# EAGLE design PulseChord (EAGLE 9.6.2)
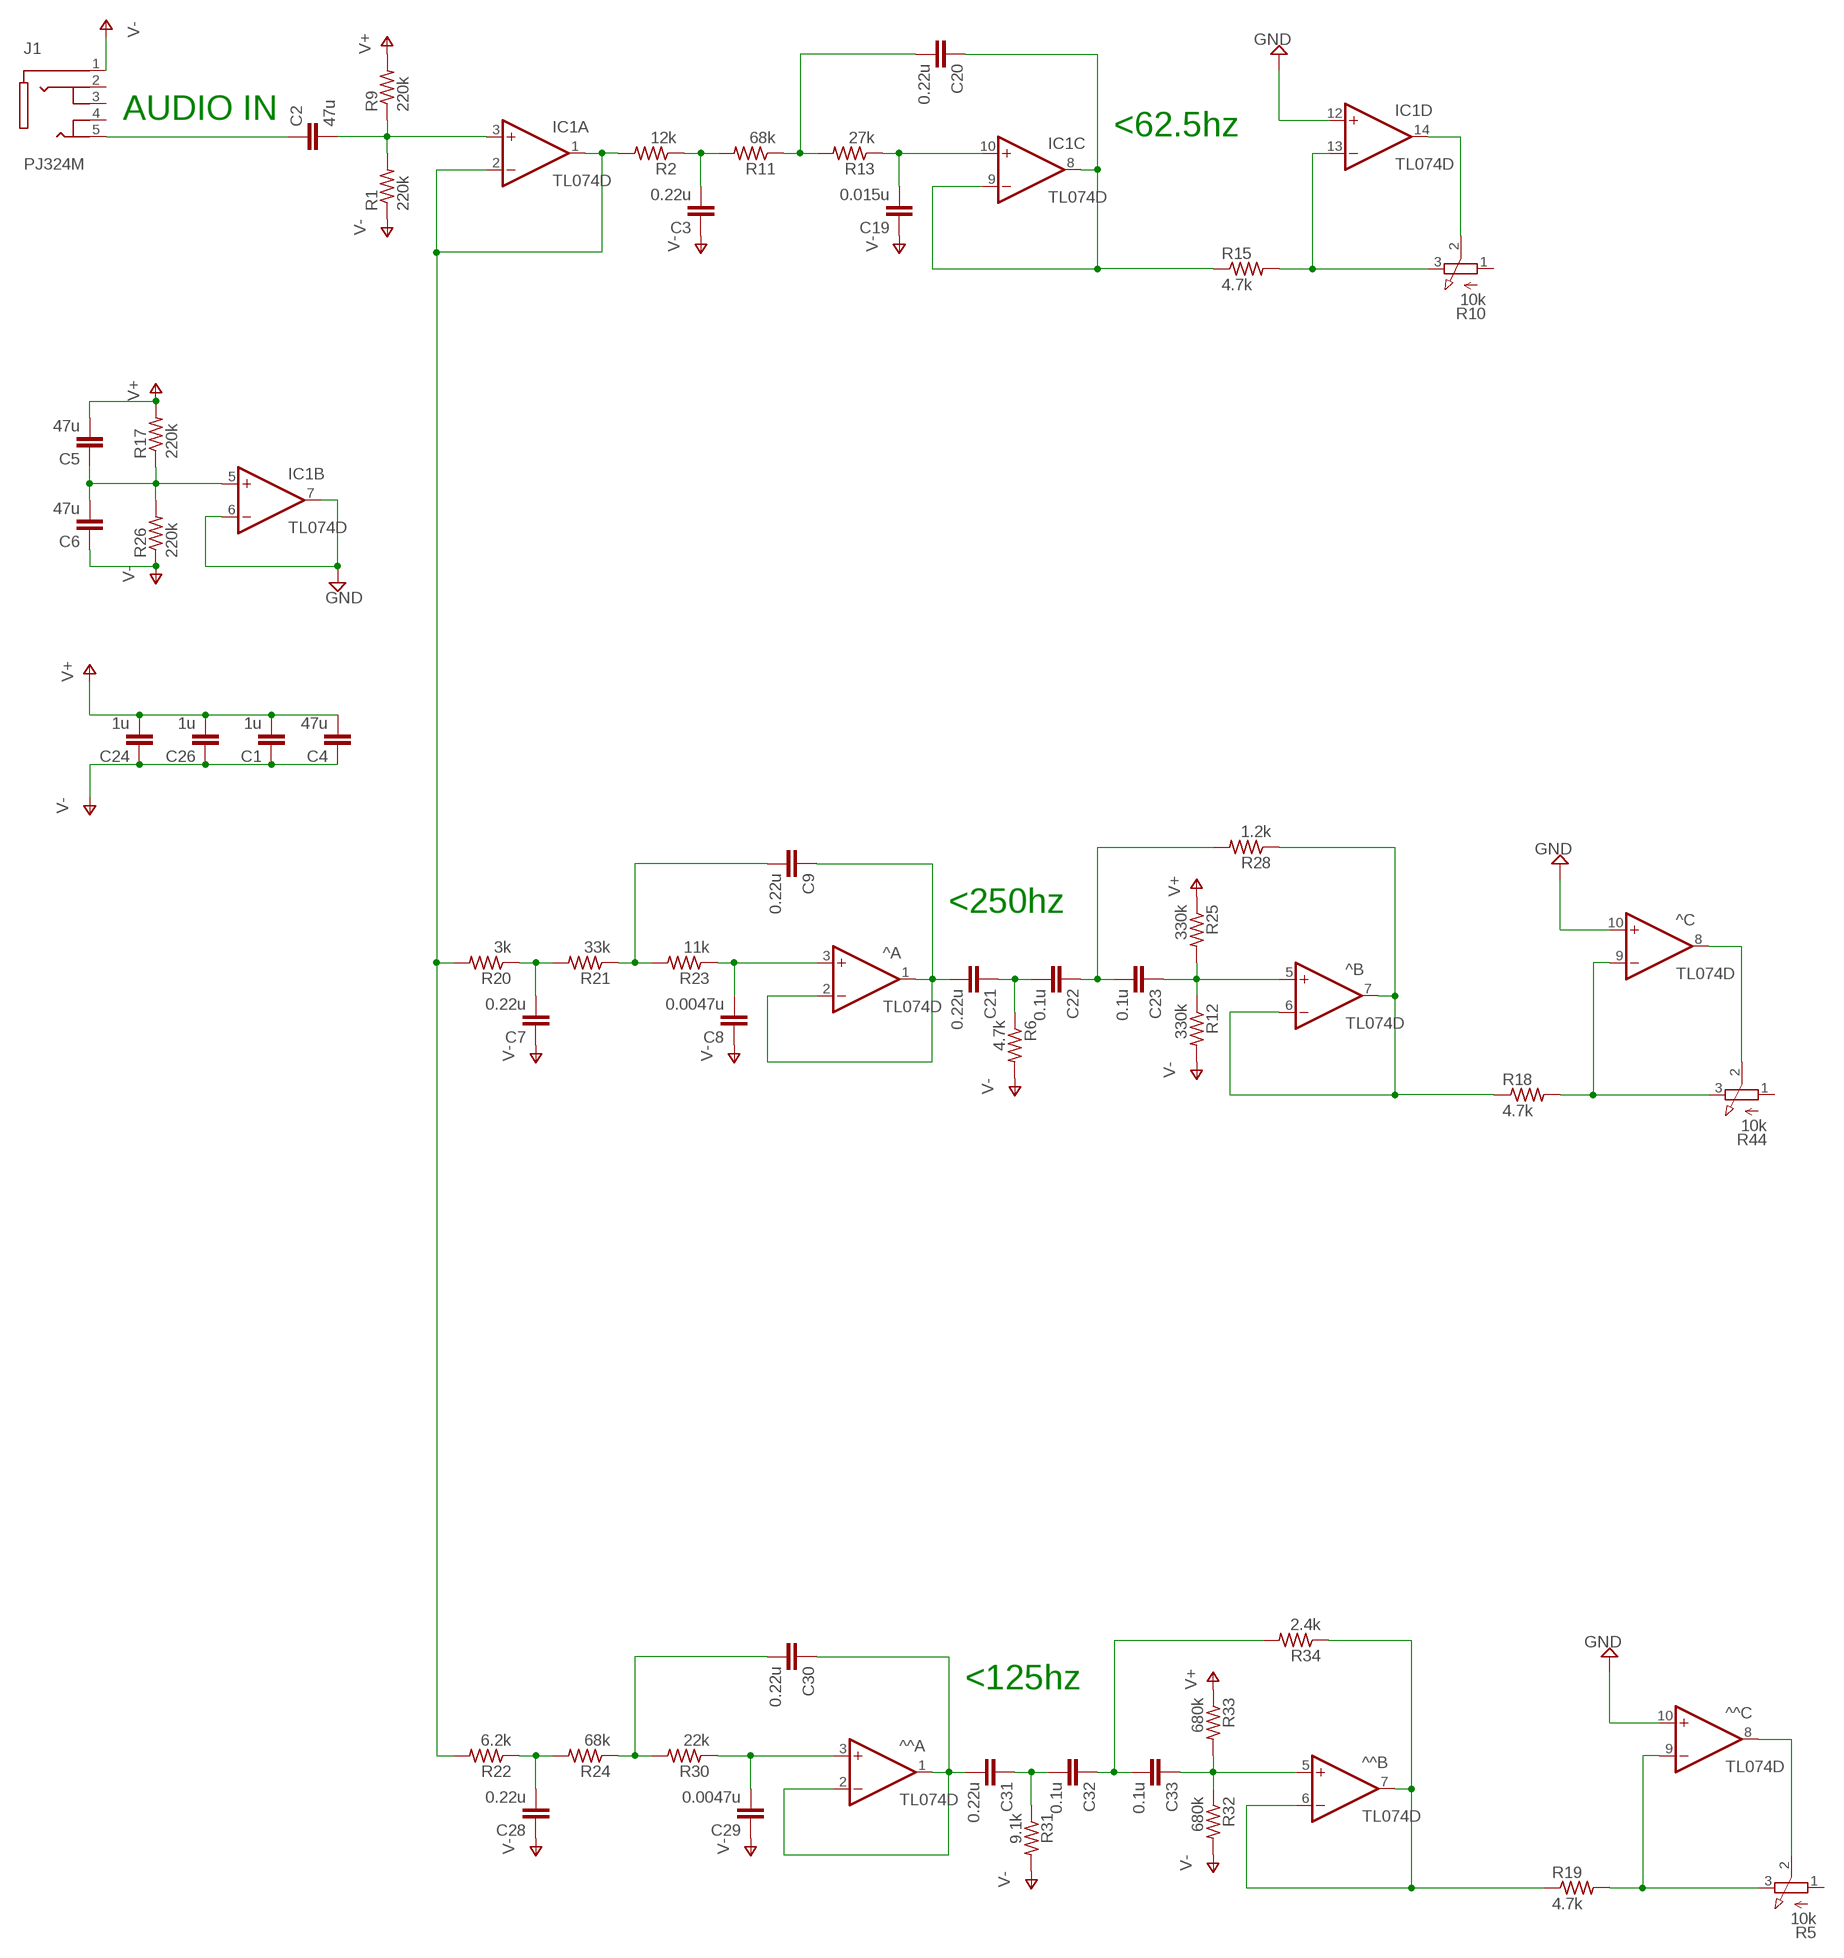
[diagram p0: schematic, sheet 1]

## Parts
^  TL074D  [SO14]
^^  TL074D  [SO14]
C1  1u  C-EUC0603  [C0603]
C2  47u  C-EUC0603  [C0603]
C3  0.22u  C-EUC0603  [C0603]
C4  47u  C-EUC0603  [C0603]
C5  47u  C-EUC0603  [C0603]
C6  47u  C-EUC0603  [C0603]
C7  0.22u  C-EUC0603  [C0603]
C8  0.0047u  C-EUC0603  [C0603]
C9  0.22u  C-EUC0603  [C0603]
C19  0.015u  C-EUC0603  [C0603]
C20  0.22u  C-EUC0603  [C0603]
C21  0.22u  C-EUC0603  [C0603]
C22  0.1u  C-EUC0603  [C0603]
C23  0.1u  C-EUC0603  [C0603]
C24  1u  C-EUC0603  [C0603]
C26  1u  C-EUC0603  [C0603]
C28  0.22u  C-EUC0603  [C0603]
C29  0.0047u  C-EUC0603  [C0603]
C30  0.22u  C-EUC0603  [C0603]
C31  0.22u  C-EUC0603  [C0603]
C32  0.1u  C-EUC0603  [C0603]
C33  0.1u  C-EUC0603  [C0603]
IC1  TL074D  [SO14]
J1  PJ324M  [WENZHOU_PJ324M]
R1  220k  R-US_R0603  [R0603]
R2  12k  R-US_R0603  [R0603]
R5  10k  3RP/1610N  [3RP/1610N]
R6  4.7k  R-US_R0603  [R0603]
R9  220k  R-US_R0603  [R0603]
R10  10k  3RP/1610N  [3RP/1610N]
R11  68k  R-US_R0603  [R0603]
R12  330k  R-US_R0603  [R0603]
R13  27k  R-US_R0603  [R0603]
R15  4.7k  R-US_R0603  [R0603]
R17  220k  R-US_R0603  [R0603]
R18  4.7k  R-US_R0603  [R0603]
R19  4.7k  R-US_R0603  [R0603]
R20  3k  R-US_R0603  [R0603]
R21  33k  R-US_R0603  [R0603]
R22  6.2k  R-US_R0603  [R0603]
R23  11k  R-US_R0603  [R0603]
R24  68k  R-US_R0603  [R0603]
R25  330k  R-US_R0603  [R0603]
R26  220k  R-US_R0603  [R0603]
R28  1.2k  R-US_R0603  [R0603]
R30  22k  R-US_R0603  [R0603]
R31  9.1k  R-US_R0603  [R0603]
R32  680k  R-US_R0603  [R0603]
R33  680k  R-US_R0603  [R0603]
R34  2.4k  R-US_R0603  [R0603]
R44  10k  3RP/1610N  [3RP/1610N]

## Nets
GND: ^.10(C:+IN) ^^.10(C:+IN) IC1.6(B:-IN) IC1.7(B:OUT) IC1.12(D:+IN)
N$1: IC1.1(A:OUT) IC1.2(A:-IN) R2.2 R20.2 R22.2
N$2: C2.2 IC1.3(A:+IN) R1.2 R9.1
N$3: ^^.9(C:-IN) R5.3(E) R19.2
N$6: ^^.8(C:OUT) R5.2(S)
N$7: C5.1 C6.2 IC1.5(B:+IN) R17.1 R26.2
N$9: ^.3(A:+IN) C8.2 R23.1
N$11: IC1.13(D:-IN) R10.3(E) R15.2
N$12: C9.2 R21.1 R23.2
N$13: C3.2 R2.1 R11.2
N$14: C2.1 J1.5(TIP_2)
N$16: C21.1 C22.2 R6.1
N$17: ^.1(A:OUT) ^.2(A:-IN) C9.1 C21.2
N$19: C31.1 C32.2 R31.1
N$20: C19.2 IC1.10(C:+IN) R13.1
N$23: ^^.1(A:OUT) ^^.2(A:-IN) C30.1 C31.2
N$25: C32.1 C33.2 R34.2
N$27: C22.1 C23.2 R28.2
N$29: ^^.5(B:+IN) C33.1 R32.1 R33.2
N$30: C7.2 R20.1 R21.2
N$32: ^^.6(B:-IN) ^^.7(B:OUT) R19.1 R34.1
N$33: C28.2 R22.1 R24.2
N$34: IC1.14(D:OUT) R10.2(S)
N$35: C20.2 R11.1 R13.2
N$36: ^.9(C:-IN) R18.2 R44.3(E)
N$37: ^.5(B:+IN) C23.1 R12.1 R25.2
N$38: ^.8(C:OUT) R44.2(S)
N$41: C30.2 R24.1 R30.2
N$43: ^.6(B:-IN) ^.7(B:OUT) R18.1 R28.1
N$46: C20.1 IC1.8(C:OUT) IC1.9(C:-IN) R15.1
N$47: ^^.3(A:+IN) C29.2 R30.1
V+: C1.2 C4.2 C5.2 C24.2 C26.2 R9.2 R17.2 R25.1 R33.1
V-: C1.1 C3.1 C4.1 C6.1 C7.1 C8.1 C19.1 C24.1 C26.1 C28.1 C29.1 J1.1(SLEEVE) R1.1 R6.2 R12.2 R26.1 R31.2 R32.2
Unconnected: ^.12(D:+IN) ^.13(D:-IN) ^.14(D:OUT) ^^.12(D:+IN) ^^.13(D:-IN) ^^.14(D:OUT) J1.2(RING_1) J1.3(RING_2) J1.4(TIP_1) R5.1(A) R10.1(A) R44.1(A)

## Notes on the sheet
- AUDIO IN
- <62.5hz
- <250hz
- <125hz

## Power pins joined to a net without a drawn wire
V+: ^.4(P:V+) ^^.4(P:V+) IC1.4(P:V+)
V-: ^.11(P:V-) ^^.11(P:V-) IC1.11(P:V-)

## Library data of the parts
^ ^^ IC1 = linear:TL074: OP AMP
C1-C9 C19-C24 C26 C28-C33 = rcl:C-EU: CAPACITOR, European symbol; SPICEPREFIX: C
J1 = PJ324M:PJ324M: Check availability <https://pricing.snapeda.com/parts/PJ324M/Wenzhou%20QingPu%20Electronics%20Co.Ltd/view-part?ref=eda>; AVAILABILITY: Not in stock; CHECK_PRICES: https://www.snapeda.com/parts/PJ324M/Wenzhou+QingPu+Electronics+Co.Ltd/view-part/?ref=eda; DESCRIPTION: Headphone Stereo jack/Audio connector; MF: Wenzhou QingPu Electronics Co.Ltd; MP: PJ324M; PACKAGE: Package; PRICE: None; SNAPEDA_LINK: https://www.snapeda.com/parts/PJ324M/Wenzhou+QingPu+Electronics+Co.Ltd/view-part/?ref=snap
R1 R2 R6 R9 R11-R13 R15 R17-R26 R28 R30-R34 = rcl:R-US_: RESISTOR, American symbol; SPICEPREFIX: R
R5 R10 R44 = pot:3RP/1610N: 16mm Potentiometer one level Source: http://www.alphapotentiometers.net/html/16mm_pot_2.html

## Board
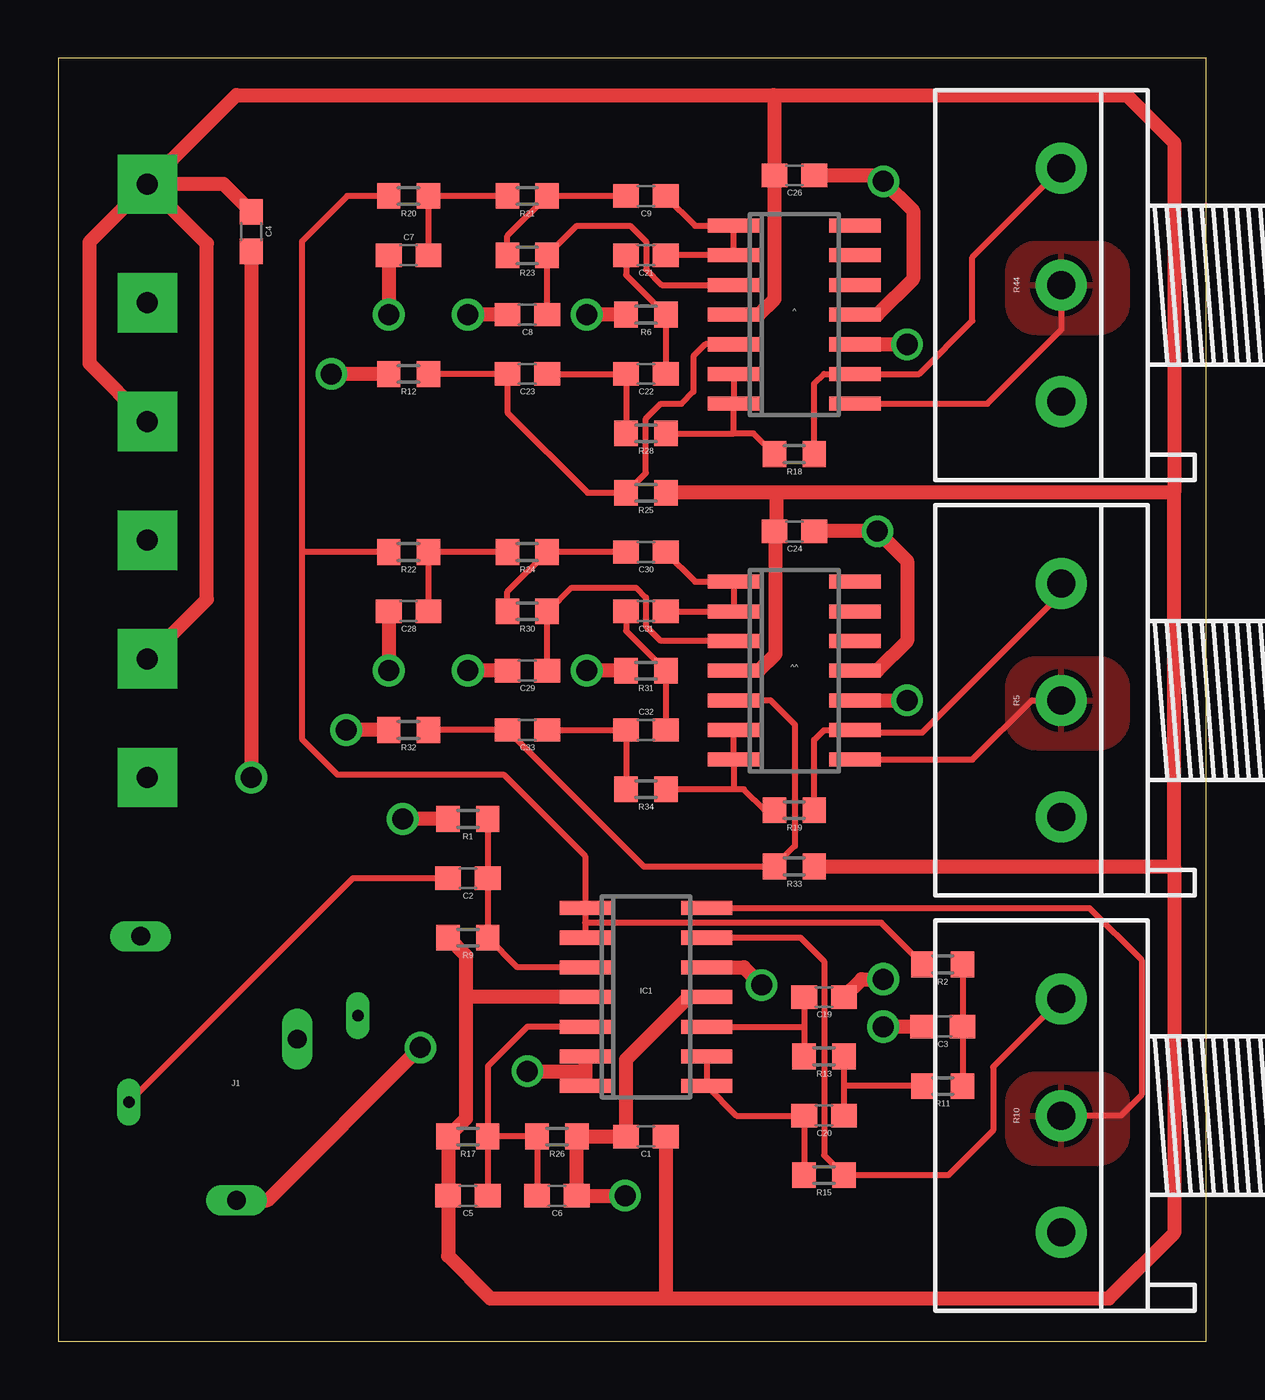
[diagram p1: board, top side]
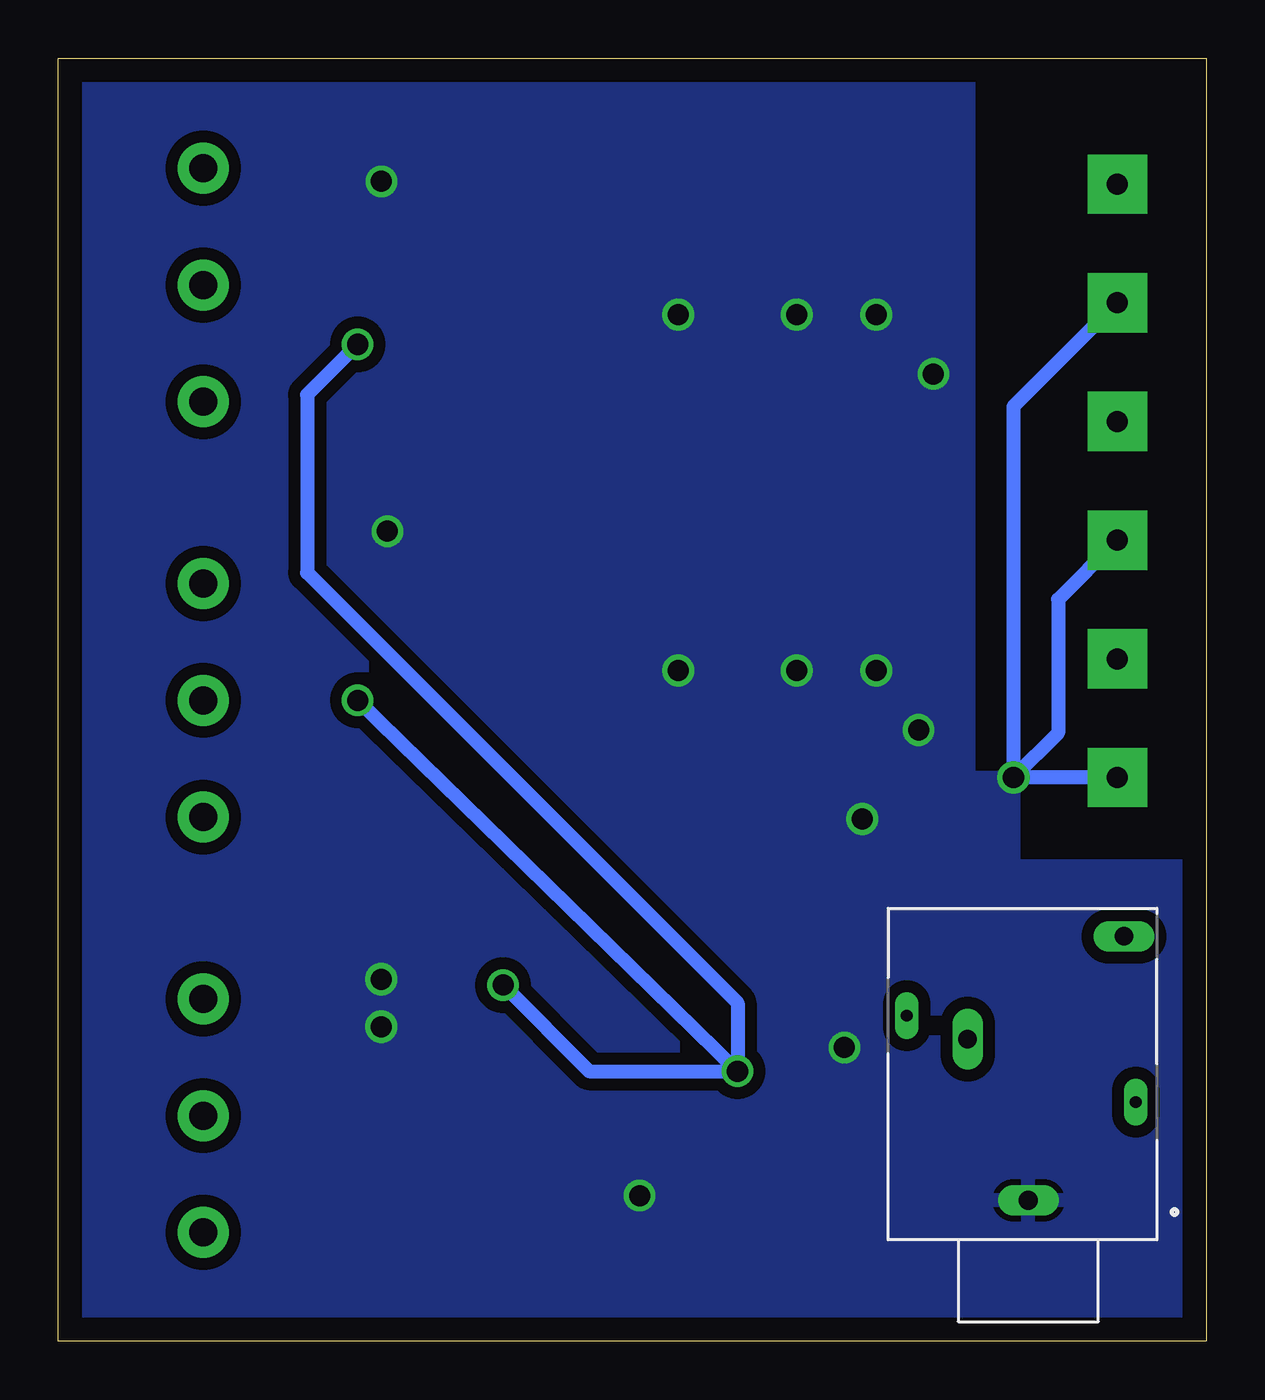
[diagram p2: board, bottom side, seen from below]

Size 49.13 x 54.91 mm. Coordinates in mm from the lower left corner, seen from the top.
Outline: 0,0 49.13,0 49.13,54.91 0,54.91 0,0
Copper layers (1*16): Top 0.035mm / dielectric 1.5mm / Bottom 0.035mm
Design rules "default": minimum track width 6mil, minimum drill 0.35mm, track to track 6mil, track to pad 6mil, pad to pad 6mil, via to via 6mil, smd to smd 6mil, copper to edge 40mil, drill to drill 6mil, minimum pad ring 10mil, minimum via ring 8mil, stop-mask expansion 4mil, vias tented up to drill 0mil, thermal gap 10mil

### Footprints (pad centres in the part's own frame; a part is rotated, then mirrored left to right if it is on the bottom)
SO14 = smd 0.6 x 2.2: 1 -3.81,-2.6; 2 -2.54,-2.6; 3 -1.27,-2.6; 4 0,-2.6; 5 1.27,-2.6; 6 2.54,-2.6; 7 3.81,-2.6; 8 3.81,2.6; 9 2.54,2.6; 10 1.27,2.6; 11 0,2.6; 12 -1.27,2.6; 13 -2.54,2.6; 14 -3.81,2.6
C0603 = smd 1.1 x 1: 1 -0.85,0; 2 0.85,0
WENZHOU_PJ324M = drill 0.8 long: 1 0,5.4; 3 2.6,-1.5; 4 -4.1,-5.9 | drill 0.5 long: 2 5.2,-2.5; 5 -4.6,1.2
R0603 = smd 1 x 1.1: 1 -0.85,0; 2 0.85,0
3RP/1610N = drill 1.2 pad 2.184: 1 -5,0; 2 0,0; 3 5,0

### Placement (x,y rotation side)
^  31.5,43.94 270 top
^^  31.5,28.7 270 top
C1  25.15,8.76 0 top
C2  17.53,19.81 0 top
C3  37.85,13.46 0 top
C4  8.26,47.5 90 top
C5  17.53,6.22 180 top
C6  21.34,6.22 180 top
C7  14.99,46.48 0 top
C8  20.07,43.94 0 top
C9  25.15,49.02 180 top
C19  32.77,14.73 180 top
C20  32.77,9.65 0 top
C21  25.15,46.48 0 top
C22  25.15,41.4 0 top
C23  20.07,41.4 0 top
C24  31.5,34.67 180 top
C26  31.5,49.91 180 top
C28  14.99,31.24 0 top
C29  20.07,28.7 0 top
C30  25.15,33.78 180 top
C31  25.15,31.24 0 top
C32  25.15,26.16 0 top
C33  20.07,26.16 0 top
IC1  25.15,14.73 270 top
J1  7.62,11.43 180 bottom
R1  17.53,22.35 0 top
R2  37.85,16.13 180 top
R5  42.93,27.43 90 top
R6  25.15,43.94 180 top
R9  17.53,17.27 180 top
R10  42.93,9.65 90 top
R11  37.85,10.92 0 top
R12  14.99,41.4 180 top
R13  32.77,12.19 0 top
R15  32.77,7.11 0 top
R17  17.53,8.76 180 top
R18  31.5,37.97 0 top
R19  31.5,22.73 0 top
R20  14.99,49.02 180 top
R21  20.07,49.02 180 top
R22  14.99,33.78 180 top
R23  20.07,46.48 180 top
R24  20.07,33.78 180 top
R25  25.15,36.32 180 top
R26  21.34,8.76 180 top
R28  25.15,38.86 180 top
R30  20.07,31.24 180 top
R31  25.15,28.7 180 top
R32  14.99,26.16 180 top
R33  31.5,20.32 180 top
R34  25.15,23.62 180 top
R44  42.93,45.21 90 top

### Tracks (layer width: path | path; a pad name or v marks a point on that pad's centre or on a via)
GND  (via drill 0.9 pad 0.25, 0.9 pad 1.35)
  Top 0.61: ^^.10 v36.32,27.43 | IC1.6 22.55,11.43 | 22.55,11.43 IC1.7 | v20.07,11.56 22.42,11.56 22.55,11.43 | IC1.12 29.34,16 v30.1,15.24 | ^.10 v36.32,42.67
  Bottom 0.61: v20.07,11.56 v36.32,27.43 | v36.32,42.67 38.48,40.51 38.48,32.89 20.07,14.48 v20.07,11.56 | v30.1,15.24 26.42,11.56 v20.07,11.56
N$1
  Top 0.254: 22.55,17.91 IC1.1 22.55,20.76 19.05,24.26 11.94,24.26 10.41,25.78 10.41,33.78 | 22.55,17.91 IC1.2 | R20.2 12.36,49.02 10.41,47.08 10.41,33.78 | R22.2 10.41,33.78 | R2.2 35.22,17.91 22.55,17.91
N$2
  Top 0.254: R1.2 C2.2 R9.1 19.65,16 IC1.3
N$3
  Top 0.254: R19.2 32.35,25.74 32.77,26.16 ^^.9 34.22,26.04 36.96,26.04 42.93,32 R5.3
N$6
  Top 0.254: ^^.8 39.12,24.89 41.66,27.43 R5.2
  pour Top (isolate 0.254): 43.18,29.21 44.45,29.21 arc-90 45.72,27.94 45.72,26.67 arc-90 44.45,25.4 43.18,25.4 41.91,25.4 arc-90 40.64,26.67 40.64,27.94 arc-90 41.91,29.21
N$7
  Top 0.254: IC1.5 20.07,13.46 18.38,11.77 R17.1 | C6.2 R26.2 R17.1 | R17.1 C5.1
N$9
  Top 0.254: C8.2 R23.1 22.19,47.75 24.47,47.75 25.15,47.07 25.15,45.88 25.82,45.21 ^.3
N$11
  Top 0.254: IC1.13 31.75,17.27 32.77,16.26 32.77,7.96 R15.2 38.1,7.11 40.01,9.02 40.01,11.73 R10.3
N$12
  Top 0.254: C9.2 R21.1 19.22,47.32 R23.2
N$13
  Top 0.254: R11.2 C3.2 R2.1
N$14
  Top 0.254: C2.1 12.7,19.81 12.6,19.81 J1.5
N$16
  Top 0.254: C21.1 24.3,45.64 R6.1 C22.2
N$17
  Top 0.254: C9.1 26,49 27.25,47.75 ^.1 ^.2 C21.2
N$19
  Top 0.254: C32.2 R31.1 24.3,30.4 C31.1
N$20
  Top 0.254: C19.2 31.92,13.46 | 31.92,13.46 R13.1 | IC1.10 31.92,13.46
N$23
  Top 0.254: C30.1 26,33.76 27.25,32.51 ^^.1 ^^.2 C31.2
N$25
  Top 0.254: C33.2 C32.1 R34.2
N$27
  Top 0.254: R28.2 C22.1 C23.2
N$29
  Top 0.254: R32.1 C33.1 25.06,20.32 R33.2 31.52,21.19 31.52,26.4 30.48,27.43 ^^.5
N$30
  Top 0.254: R21.2 R20.1 C7.2
N$32
  Top 0.254: ^^.6 ^^.7 28.9,23.69 28.83,23.62 | R19.1 30.23,22.73 29.34,23.62 28.83,23.62 | 28.83,23.62 R34.1
N$33
  Top 0.254: R24.2 R22.1 C28.2
N$34
  Top 0.254: IC1.14 44.12,18.54 46.35,16.31 46.35,10.54 45.47,9.65 R10.2
  pour Top (isolate 0.254): 43.18,11.43 44.45,11.43 arc-90 45.72,10.16 45.72,8.89 arc-90 44.45,7.62 43.18,7.62 41.91,7.62 arc-90 40.64,8.89 40.64,10.16 arc-90 41.91,11.43
N$35
  Top 0.254: R13.2 33.62,10.92 | 33.62,10.92 C20.2 | R11.1 33.62,10.92
N$36
  Top 0.254: R18.2 32.35,40.98 32.77,41.4 ^.9 36.83,41.4 39.12,43.69 39.12,46.4 R44.3
N$37
  Top 0.254: R12.1 C23.1 19.22,39.75 22.64,36.32 R25.2 25.15,37.17 25.15,39.5 25.78,40.13 26.67,40.13 27.18,40.64 27.18,42.16 27.69,42.67 ^.5
N$38
  Top 0.254: ^.8 39.75,40.13 42.93,43.31 R44.2
  pour Top (isolate 0.254): 41.91,46.99 43.18,46.99 44.45,46.99 arc-90 45.72,45.72 45.72,44.45 arc-90 44.45,43.18 43.18,43.18 41.91,43.18 arc-90 40.64,44.45 40.64,45.72 arc-90
N$41
  Top 0.254: C30.2 R24.1 19.22,32.08 R30.2
N$43
  Top 0.254: ^.6 ^.7 28.9,38.86 | R18.1 29.76,38.86 28.9,38.86 | R28.1 28.9,38.86
N$46
  Top 0.254: IC1.9 IC1.8 29.02,9.65 C20.1 R15.1
N$47
  Top 0.254: C29.2 R30.1 20.95,31.24 21.97,32.26 24.73,32.26 25.15,31.84 25.15,30.61 25.78,29.97 ^^.3
V+  (via drill 0.9 pad 2.54)
  Top 0.61: ^.4 29.97,43.94 30.65,44.62 C26.2 30.65,53.3 30.61,53.34 | 47.75,36.32 47.75,51.31 45.72,53.34 30.61,53.34 | 47.75,36.32 30.73,36.32 | 47.75,20.32 47.75,4.62 44.96,1.83 26,1.83 | R33.1 47.75,20.32 | C4.2 7.07,49.53 v3.81,49.53 | v3.81,49.53 7.62,53.34 30.61,53.34 | v3.81,49.53 1.32,47.04 1.32,41.86 v3.81,39.37 | v3.81,29.21 6.35,31.75 6.35,46.99 v3.81,49.53 | 30.73,36.32 30.73,34.76 C24.2 30.7,34.62 30.7,29.42 29.97,28.7 ^^.4 | 30.73,36.32 R25.1 | 47.75,20.32 47.75,36.32 | 17.44,14.73 17.44,9.53 R17.2 C5.2 16.68,3.64 18.49,1.83 26,1.83 | IC1.4 17.44,14.73 | R9.2 17.44,16.51 17.44,14.73 | C1.2 26,1.83
V-  (via drill 0.9 pad 0.25, 0.9 pad 1.35, 0.9 pad 1.38, 0.9 pad 2.54)
  Top 0.61: ^^.11 35.05,28.7 36.32,29.97 36.32,33.4 v35.05,34.67 C24.1 | ^.11 35.05,43.94 36.58,45.47 36.58,48.39 v35.31,49.66 35.05,49.91 C26.1 | IC1.11 26.97,14.73 24.3,12.06 C1.1 24.26,8.72 24.22,8.76 R26.1 C6.1 v24.26,6.22 | C4.1 v8.26,24.13 | R1.1 v14.73,22.35 | R32.2 v12.32,26.16 | R12.2 v11.68,41.4 | C7.1 v14.14,43.94 | C8.1 v17.53,43.94 | C29.1 v17.53,28.7 | C28.1 v14.14,28.7 v14.13,28.7 | C3.1 v35.31,13.46 | C19.1 34.38,15.49 v35.31,15.49 | R31.2 v22.61,28.7 | R6.2 v22.61,43.94 | J1.1 8.95,6.03 v15.49,12.57
  Bottom 0.61: v3.81,44.45 8.26,40.01 v8.26,24.13 | v3.81,34.29 6.35,31.75 6.35,26.04 v8.26,24.13 | v3.81,24.13 v8.26,24.13
  pour Bottom (isolate 0.61): 10.16,24.13 8.26,24.13 8.26,20.32 10.16,20.32
  pour Bottom (isolate 0.508): 0,0 0,20.32 10.16,20.32 10.16,54.61 49.53,54.61 49.53,0